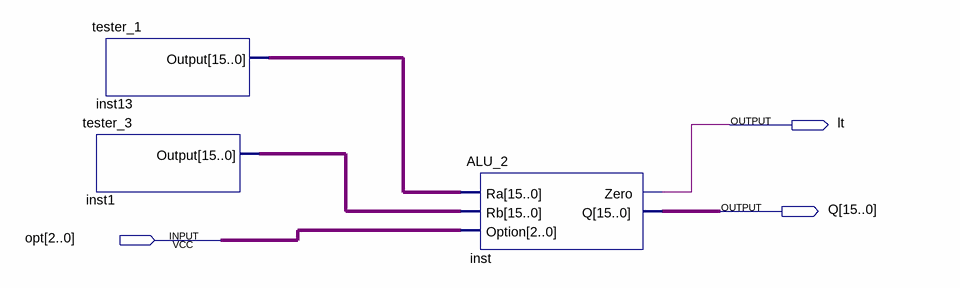
[diagram p0: schematic sheet]
// Quartus schematic test_ALU_3.bdf as structural Verilog: 3 symbols, 3 pins
module test_ALU_3 (
  input  [2:0] opt,
  output lt,
  output [15:0] Q
);

  wire [15:0] inst1_output, inst13_output;

  tester_1 inst13 (.Output(inst13_output));
  tester_3 inst1 (.Output(inst1_output));
  ALU_2 inst (.Ra(inst13_output), .Rb(inst1_output), .Option(opt), .Zero(lt), .Q(Q));
endmodule
